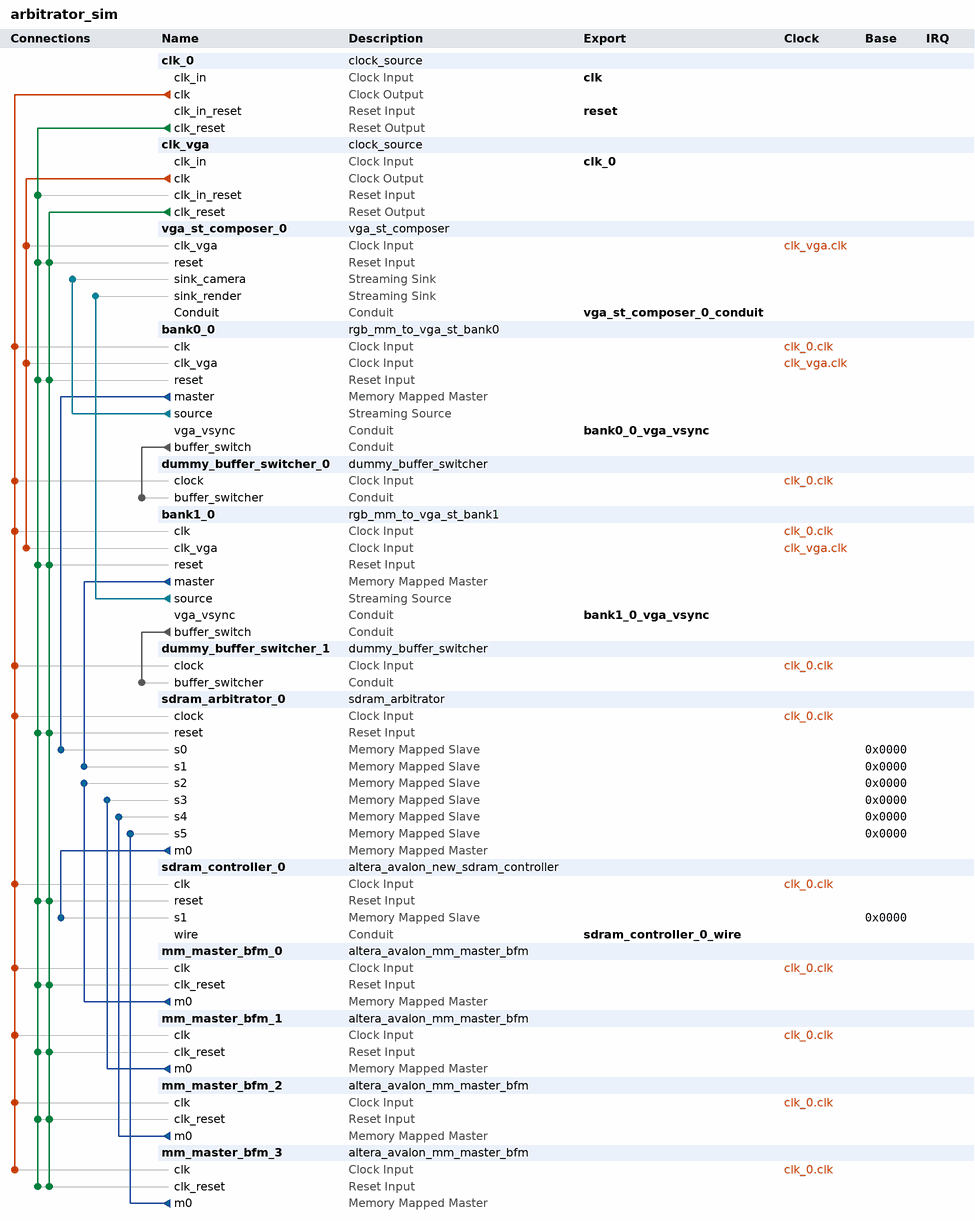
[diagram p0: system contents]
# Platform Designer (Qsys) system arbitrator_sim, Cyclone IV GX EP4CGX150DF31C7
# Parameters at their usual value, and those the tool derives, are not listed.
package require -exact qsys 15.0
create_system arbitrator_sim
set_project_property DEVICE_FAMILY {Cyclone IV GX}
set_project_property DEVICE EP4CGX150DF31C7

add_instance clk_0 clock_source 15.0
set_instance_parameter_value clk_0 clockFrequency 50000000

add_instance clk_vga clock_source 15.0
set_instance_parameter_value clk_vga clockFrequency 24000000

add_instance vga_st_composer_0 vga_st_composer 1.0
set_instance_parameter_value vga_st_composer_0 DATA_WIDTH 32
set_instance_parameter_value vga_st_composer_0 FIFO_LENGTH_LOG_2 6

add_instance bank0_0 rgb_mm_to_vga_st_bank0 1.0

add_instance dummy_buffer_switcher_0 dummy_buffer_switcher 1.0
set_instance_parameter_value dummy_buffer_switcher_0 FIXED_BUFFER_PORT 0

add_instance bank1_0 rgb_mm_to_vga_st_bank1 1.0

add_instance dummy_buffer_switcher_1 dummy_buffer_switcher 1.0
set_instance_parameter_value dummy_buffer_switcher_1 FIXED_BUFFER_PORT 0

add_instance sdram_arbitrator_0 sdram_arbitrator 1.0

add_instance sdram_controller_0 altera_avalon_new_sdram_controller 15.0
set_instance_parameter_value sdram_controller_0 TAC 5.5
set_instance_parameter_value sdram_controller_0 TRCD 20.0
set_instance_parameter_value sdram_controller_0 TRP 20.0
set_instance_parameter_value sdram_controller_0 casLatency 3
set_instance_parameter_value sdram_controller_0 columnWidth 10
set_instance_parameter_value sdram_controller_0 dataWidth 32
set_instance_parameter_value sdram_controller_0 generateSimulationModel true
set_instance_parameter_value sdram_controller_0 initRefreshCommands 8
set_instance_parameter_value sdram_controller_0 model single_Micron_MT48LC4M32B2_7_chip
set_instance_parameter_value sdram_controller_0 numberOfBanks 4
set_instance_parameter_value sdram_controller_0 numberOfChipSelects 1
set_instance_parameter_value sdram_controller_0 powerUpDelay 100.0
set_instance_parameter_value sdram_controller_0 refreshPeriod 7.8125
set_instance_parameter_value sdram_controller_0 rowWidth 13

add_instance mm_master_bfm_0 altera_avalon_mm_master_bfm 15.0
set_instance_parameter_value mm_master_bfm_0 ADDRESS_UNITS SYMBOLS
set_instance_parameter_value mm_master_bfm_0 AV_ADDRESS_W 27
set_instance_parameter_value mm_master_bfm_0 AV_ALWAYS_BURST_MAX_BURST 0
set_instance_parameter_value mm_master_bfm_0 AV_BURSTCOUNT_W 3
set_instance_parameter_value mm_master_bfm_0 AV_BURST_BNDR_ONLY 1
set_instance_parameter_value mm_master_bfm_0 AV_BURST_LINEWRAP 1
set_instance_parameter_value mm_master_bfm_0 AV_CONSTANT_BURST_BEHAVIOR 1
set_instance_parameter_value mm_master_bfm_0 AV_FIX_READ_LATENCY 1
set_instance_parameter_value mm_master_bfm_0 AV_MAX_PENDING_WRITES 0
set_instance_parameter_value mm_master_bfm_0 AV_NUMSYMBOLS 4
set_instance_parameter_value mm_master_bfm_0 AV_READRESPONSE_W 8
set_instance_parameter_value mm_master_bfm_0 AV_READ_WAIT_TIME 1
set_instance_parameter_value mm_master_bfm_0 AV_WRITERESPONSE_W 8
set_instance_parameter_value mm_master_bfm_0 USE_BURSTCOUNT 0
set_instance_parameter_value mm_master_bfm_0 USE_BYTE_ENABLE 1
set_instance_parameter_value mm_master_bfm_0 USE_READ 1
set_instance_parameter_value mm_master_bfm_0 USE_READ_DATA 1
set_instance_parameter_value mm_master_bfm_0 USE_READ_DATA_VALID 1
set_instance_parameter_value mm_master_bfm_0 USE_WAIT_REQUEST 1
set_instance_parameter_value mm_master_bfm_0 VHDL_ID 0

add_instance mm_master_bfm_1 altera_avalon_mm_master_bfm 15.0
set_instance_parameter_value mm_master_bfm_1 ADDRESS_UNITS SYMBOLS
set_instance_parameter_value mm_master_bfm_1 AV_ADDRESS_W 27
set_instance_parameter_value mm_master_bfm_1 AV_ALWAYS_BURST_MAX_BURST 0
set_instance_parameter_value mm_master_bfm_1 AV_BURSTCOUNT_W 3
set_instance_parameter_value mm_master_bfm_1 AV_BURST_BNDR_ONLY 1
set_instance_parameter_value mm_master_bfm_1 AV_BURST_LINEWRAP 1
set_instance_parameter_value mm_master_bfm_1 AV_CONSTANT_BURST_BEHAVIOR 1
set_instance_parameter_value mm_master_bfm_1 AV_FIX_READ_LATENCY 1
set_instance_parameter_value mm_master_bfm_1 AV_MAX_PENDING_WRITES 0
set_instance_parameter_value mm_master_bfm_1 AV_NUMSYMBOLS 4
set_instance_parameter_value mm_master_bfm_1 AV_READRESPONSE_W 8
set_instance_parameter_value mm_master_bfm_1 AV_READ_WAIT_TIME 1
set_instance_parameter_value mm_master_bfm_1 AV_WRITERESPONSE_W 8
set_instance_parameter_value mm_master_bfm_1 USE_BURSTCOUNT 0
set_instance_parameter_value mm_master_bfm_1 USE_BYTE_ENABLE 1
set_instance_parameter_value mm_master_bfm_1 USE_READ 1
set_instance_parameter_value mm_master_bfm_1 USE_READ_DATA 1
set_instance_parameter_value mm_master_bfm_1 USE_READ_DATA_VALID 1
set_instance_parameter_value mm_master_bfm_1 USE_WAIT_REQUEST 1
set_instance_parameter_value mm_master_bfm_1 VHDL_ID 0

add_instance mm_master_bfm_2 altera_avalon_mm_master_bfm 15.0
set_instance_parameter_value mm_master_bfm_2 ADDRESS_UNITS SYMBOLS
set_instance_parameter_value mm_master_bfm_2 AV_ADDRESS_W 27
set_instance_parameter_value mm_master_bfm_2 AV_ALWAYS_BURST_MAX_BURST 0
set_instance_parameter_value mm_master_bfm_2 AV_BURSTCOUNT_W 3
set_instance_parameter_value mm_master_bfm_2 AV_BURST_BNDR_ONLY 1
set_instance_parameter_value mm_master_bfm_2 AV_BURST_LINEWRAP 1
set_instance_parameter_value mm_master_bfm_2 AV_CONSTANT_BURST_BEHAVIOR 1
set_instance_parameter_value mm_master_bfm_2 AV_FIX_READ_LATENCY 1
set_instance_parameter_value mm_master_bfm_2 AV_MAX_PENDING_WRITES 0
set_instance_parameter_value mm_master_bfm_2 AV_NUMSYMBOLS 4
set_instance_parameter_value mm_master_bfm_2 AV_READRESPONSE_W 8
set_instance_parameter_value mm_master_bfm_2 AV_READ_WAIT_TIME 1
set_instance_parameter_value mm_master_bfm_2 AV_WRITERESPONSE_W 8
set_instance_parameter_value mm_master_bfm_2 USE_BURSTCOUNT 0
set_instance_parameter_value mm_master_bfm_2 USE_BYTE_ENABLE 1
set_instance_parameter_value mm_master_bfm_2 USE_READ 1
set_instance_parameter_value mm_master_bfm_2 USE_READ_DATA 1
set_instance_parameter_value mm_master_bfm_2 USE_READ_DATA_VALID 1
set_instance_parameter_value mm_master_bfm_2 USE_WAIT_REQUEST 1
set_instance_parameter_value mm_master_bfm_2 VHDL_ID 0

add_instance mm_master_bfm_3 altera_avalon_mm_master_bfm 15.0
set_instance_parameter_value mm_master_bfm_3 ADDRESS_UNITS SYMBOLS
set_instance_parameter_value mm_master_bfm_3 AV_ADDRESS_W 27
set_instance_parameter_value mm_master_bfm_3 AV_ALWAYS_BURST_MAX_BURST 0
set_instance_parameter_value mm_master_bfm_3 AV_BURSTCOUNT_W 3
set_instance_parameter_value mm_master_bfm_3 AV_BURST_BNDR_ONLY 1
set_instance_parameter_value mm_master_bfm_3 AV_BURST_LINEWRAP 1
set_instance_parameter_value mm_master_bfm_3 AV_CONSTANT_BURST_BEHAVIOR 1
set_instance_parameter_value mm_master_bfm_3 AV_FIX_READ_LATENCY 1
set_instance_parameter_value mm_master_bfm_3 AV_MAX_PENDING_WRITES 0
set_instance_parameter_value mm_master_bfm_3 AV_NUMSYMBOLS 4
set_instance_parameter_value mm_master_bfm_3 AV_READRESPONSE_W 8
set_instance_parameter_value mm_master_bfm_3 AV_READ_WAIT_TIME 1
set_instance_parameter_value mm_master_bfm_3 AV_WRITERESPONSE_W 8
set_instance_parameter_value mm_master_bfm_3 USE_BURSTCOUNT 0
set_instance_parameter_value mm_master_bfm_3 USE_BYTE_ENABLE 1
set_instance_parameter_value mm_master_bfm_3 USE_READ 1
set_instance_parameter_value mm_master_bfm_3 USE_READ_DATA 1
set_instance_parameter_value mm_master_bfm_3 USE_READ_DATA_VALID 1
set_instance_parameter_value mm_master_bfm_3 USE_WAIT_REQUEST 1
set_instance_parameter_value mm_master_bfm_3 VHDL_ID 0

# connections
add_connection clk_0.clk bank0_0.clk clock
add_connection clk_0.clk bank1_0.clk clock
add_connection clk_0.clk dummy_buffer_switcher_0.clock clock
add_connection clk_0.clk dummy_buffer_switcher_1.clock clock
add_connection clk_0.clk mm_master_bfm_0.clk clock
add_connection clk_0.clk mm_master_bfm_1.clk clock
add_connection clk_0.clk mm_master_bfm_2.clk clock
add_connection clk_0.clk mm_master_bfm_3.clk clock
add_connection clk_0.clk sdram_arbitrator_0.clock clock
add_connection clk_0.clk sdram_controller_0.clk clock
add_connection clk_vga.clk bank0_0.clk_vga clock
add_connection clk_vga.clk bank1_0.clk_vga clock
add_connection clk_vga.clk vga_st_composer_0.clk_vga clock
add_connection clk_0.clk_reset bank0_0.reset reset
add_connection clk_0.clk_reset bank1_0.reset reset
add_connection clk_0.clk_reset clk_vga.clk_in_reset reset
add_connection clk_0.clk_reset mm_master_bfm_0.clk_reset reset
add_connection clk_0.clk_reset mm_master_bfm_1.clk_reset reset
add_connection clk_0.clk_reset mm_master_bfm_2.clk_reset reset
add_connection clk_0.clk_reset mm_master_bfm_3.clk_reset reset
add_connection clk_0.clk_reset sdram_arbitrator_0.reset reset
add_connection clk_0.clk_reset sdram_controller_0.reset reset
add_connection clk_0.clk_reset vga_st_composer_0.reset reset
add_connection clk_vga.clk_reset bank0_0.reset reset
add_connection clk_vga.clk_reset bank1_0.reset reset
add_connection clk_vga.clk_reset mm_master_bfm_0.clk_reset reset
add_connection clk_vga.clk_reset mm_master_bfm_1.clk_reset reset
add_connection clk_vga.clk_reset mm_master_bfm_2.clk_reset reset
add_connection clk_vga.clk_reset mm_master_bfm_3.clk_reset reset
add_connection clk_vga.clk_reset sdram_arbitrator_0.reset reset
add_connection clk_vga.clk_reset sdram_controller_0.reset reset
add_connection clk_vga.clk_reset vga_st_composer_0.reset reset
add_connection bank0_0.master sdram_arbitrator_0.s0 avalon
set_connection_parameter_value bank0_0.master/sdram_arbitrator_0.s0 baseAddress 0x0000
add_connection bank1_0.master sdram_arbitrator_0.s1 avalon
set_connection_parameter_value bank1_0.master/sdram_arbitrator_0.s1 baseAddress 0x0000
add_connection mm_master_bfm_0.m0 sdram_arbitrator_0.s2 avalon
set_connection_parameter_value mm_master_bfm_0.m0/sdram_arbitrator_0.s2 baseAddress 0x0000
add_connection mm_master_bfm_1.m0 sdram_arbitrator_0.s3 avalon
set_connection_parameter_value mm_master_bfm_1.m0/sdram_arbitrator_0.s3 baseAddress 0x0000
add_connection mm_master_bfm_2.m0 sdram_arbitrator_0.s4 avalon
set_connection_parameter_value mm_master_bfm_2.m0/sdram_arbitrator_0.s4 baseAddress 0x0000
add_connection mm_master_bfm_3.m0 sdram_arbitrator_0.s5 avalon
set_connection_parameter_value mm_master_bfm_3.m0/sdram_arbitrator_0.s5 baseAddress 0x0000
add_connection sdram_arbitrator_0.m0 sdram_controller_0.s1 avalon
set_connection_parameter_value sdram_arbitrator_0.m0/sdram_controller_0.s1 baseAddress 0x0000
add_connection bank0_0.source vga_st_composer_0.sink_camera avalon_streaming
add_connection bank1_0.source vga_st_composer_0.sink_render avalon_streaming
add_connection bank0_0.buffer_switch dummy_buffer_switcher_0.buffer_switcher conduit
add_connection bank1_0.buffer_switch dummy_buffer_switcher_1.buffer_switcher conduit

# exported interfaces
add_interface bank0_0_vga_vsync conduit end
set_interface_property bank0_0_vga_vsync EXPORT_OF bank0_0.vga_vsync
add_interface bank1_0_vga_vsync conduit end
set_interface_property bank1_0_vga_vsync EXPORT_OF bank1_0.vga_vsync
add_interface clk clock sink
set_interface_property clk EXPORT_OF clk_0.clk_in
add_interface clk_0 clock sink
set_interface_property clk_0 EXPORT_OF clk_vga.clk_in
add_interface reset reset sink
set_interface_property reset EXPORT_OF clk_0.clk_in_reset
add_interface sdram_controller_0_wire conduit end
set_interface_property sdram_controller_0_wire EXPORT_OF sdram_controller_0.wire
add_interface vga_st_composer_0_conduit conduit end
set_interface_property vga_st_composer_0_conduit EXPORT_OF vga_st_composer_0.Conduit

set_interconnect_requirement {$system} qsys_mm.clockCrossingAdapter HANDSHAKE
set_interconnect_requirement {$system} qsys_mm.enableEccProtection FALSE
set_interconnect_requirement {$system} qsys_mm.insertDefaultSlave FALSE
set_interconnect_requirement {$system} qsys_mm.maxAdditionalLatency 1

save_system arbitrator_sim.qsys
